# Altium schematic sheet Connectors.SchDoc
size A4
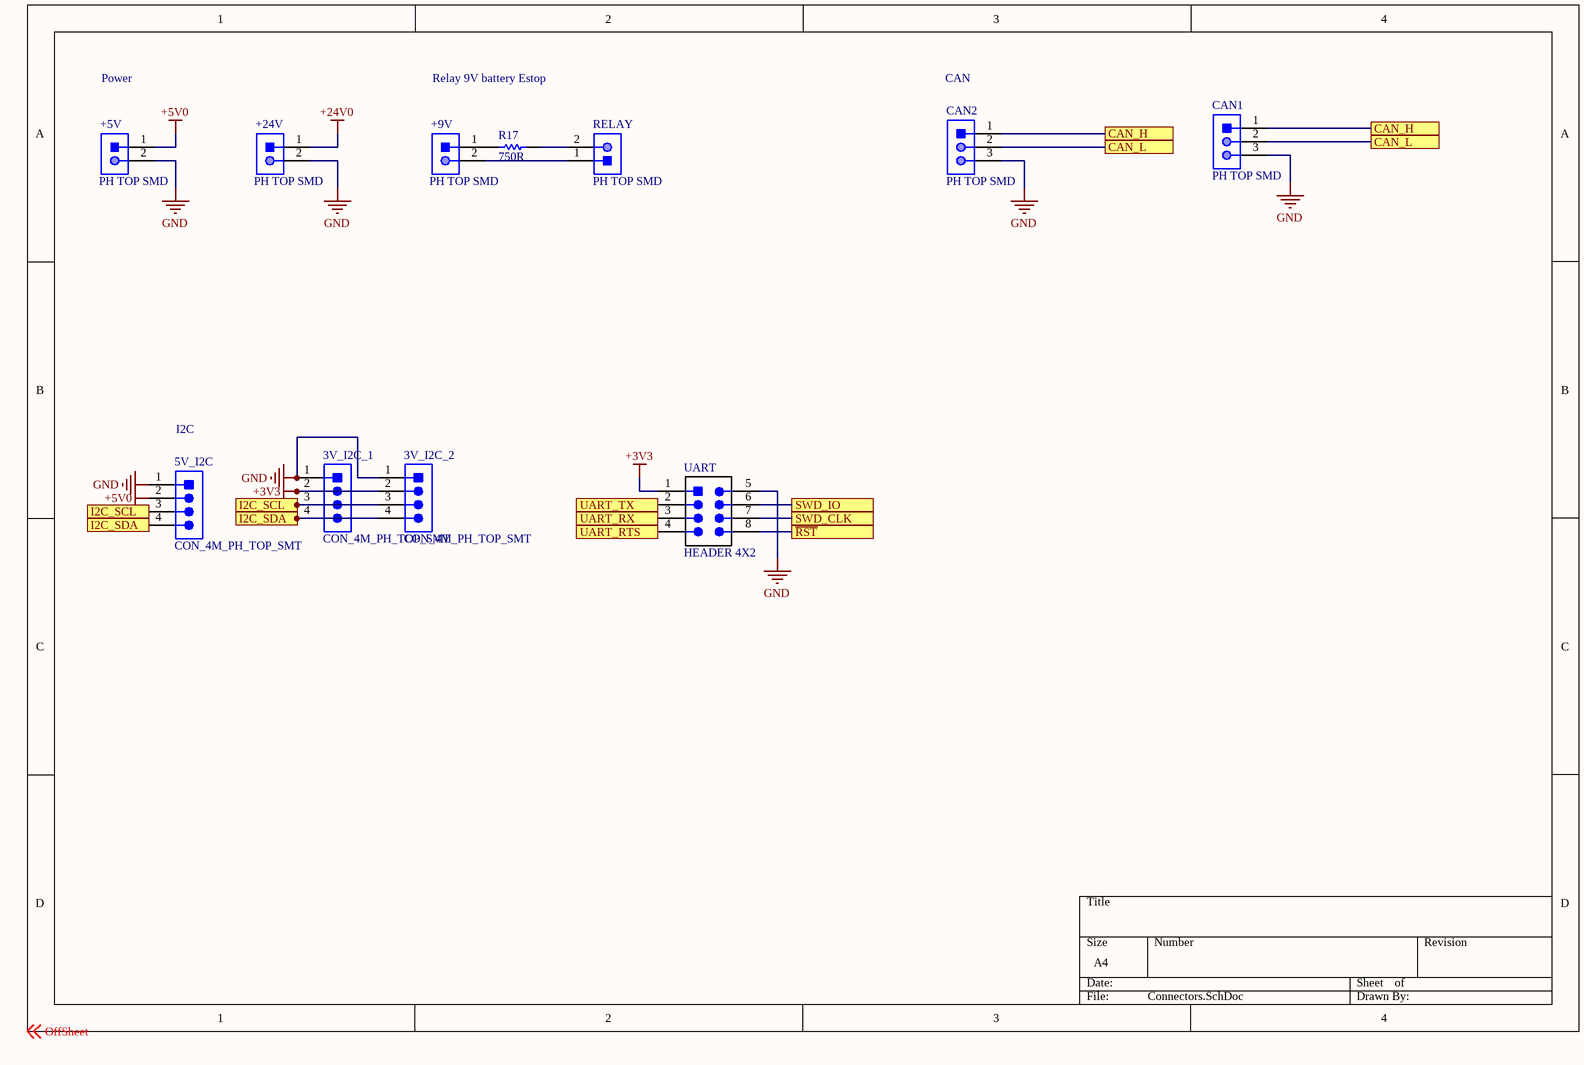
[diagram p0: Connectors.SchDoc]

## Parts
3V_I2C_1  CON_4M_PH_TOP_SMT  [JST-B4B-SM4-TB]
3V_I2C_2  CON_4M_PH_TOP_SMT  [JST-B4B-SM4-TB]
5V_I2C  CON_4M_PH_TOP_SMT  [JST-B4B-SM4-TB]
+5V  PH TOP SMD  [JST-B2B-SM4-TB]
+9V  PH TOP SMD  [JST-B2B-SM4-TB]
+24V  PH TOP SMD  [JST-B2B-SM4-TB]
CAN1  PH TOP SMD  [JST-B3B-SM4-TB]
CAN2  PH TOP SMD  [JST-B3B-SM4-TB]
R17  value 750R  [RESC0603(1608)_N]  (hidden comment: RES_750R_0603)
RELAY  PH TOP SMD  [JST-B2B-SM4-TB]
UART  HEADER 4X2  [HEADER_2X4]

## Ports
CAN_H, CAN_L, I2C_SCL, I2C_SDA, SWD_CLK, SWD_IO, UART_RTS, UART_RX, UART_TX, ~{RST}

## Nets
+3V3: 3V_I2C_1.2 3V_I2C_2.2 UART.1(VCC)
+5V0: 5V_I2C.2 +5V.1
+24V0: +24V.1
GND: 3V_I2C_1.1 3V_I2C_2.1 5V_I2C.1 +5V.2 +24V.2 CAN1.3 CAN2.3 UART.5(GND)
~{RST}: UART.8 ; port ~{RST}
CAN_H: CAN1.1 CAN2.1 ; port CAN_H
CAN_L: CAN1.2 CAN2.2 ; port CAN_L
I2C_SCL: 3V_I2C_1.3 3V_I2C_2.3 5V_I2C.3 ; port I2C_SCL
I2C_SDA: 3V_I2C_1.4 3V_I2C_2.4 5V_I2C.4 ; port I2C_SDA
SWD_CLK: UART.7 ; port SWD_CLK
SWD_IO: UART.6 ; port SWD_IO
UART_RTS: UART.4 ; port UART_RTS
UART_RX: UART.3 ; port UART_RX
UART_TX: UART.2 ; port UART_TX
Net+9V_1: +9V.1 R17.1
Net+9V_2: +9V.2 RELAY.1
NetR17_2: R17.2 RELAY.2

## Notes on the sheet
- Power
- Relay 9V battery Estop
- (near CAN2) CAN
- (near 5V_I2C) I2C
- Labels drawn without touching a wire or pin: OffSheet

## Library data of the parts
3V_I2C_1 3V_I2C_2 5V_I2C = CON_4M_PH_TOP_SMT: CONN HEADER PH TOP 4POS 2MM SMD; Manufacturer: JST; MPN: B4B-PH-SM4-TB(LF)(SN); ComponentLink1Description: Datasheet; ComponentLink1URL: http://www.jst-mfg.com/product/pdf/eng/ePH.pdf; Digikey Part Number: 455-1736-1-ND
+5V +9V +24V RELAY = CON_2M_PH_TOP_SMT: CONN HEADER PH TOP 2POS 2MM SMD; Manufacturer: JST; Part Number: B2B-PH-SM4-TB; ComponentLink1Description: Datasheet; ComponentLink1URL: http://www.jst-mfg.com/product/pdf/eng/ePH.pdf
CAN1 CAN2 = CON_3M_PH_TOP_SMT: CONN HEADER PH TOP 3POS 2MM SMD; Manufacturer: JST; Part Number: B3B-PH-SM4-TB; ComponentLink1Description: Datasheet; ComponentLink1URL: http://www.jst-mfg.com/product/pdf/eng/ePH.pdf
R17 = RES_750R_0603: RES SMD 750 OHM 0.5% 1/10W 0603; Manufacturer: Yageo; MPN: RC0603JR-07750RL; Tolerance: 5%; Package: 0603 (1608 Metric); Dimensions: 0.063" L x 0.031" W (1.60mm x 0.80mm); Digikey Part Number: 311-750GRCT-ND
UART = HEADER 4X2: Header, 4-Pin Dual row; LatestRevisionDate: 17-Jul-2002; LatestRevisionNote: Re-released for DXP Platform.; Publisher: Altium Limited